# EAGLE design regulator (EAGLE 4.16)
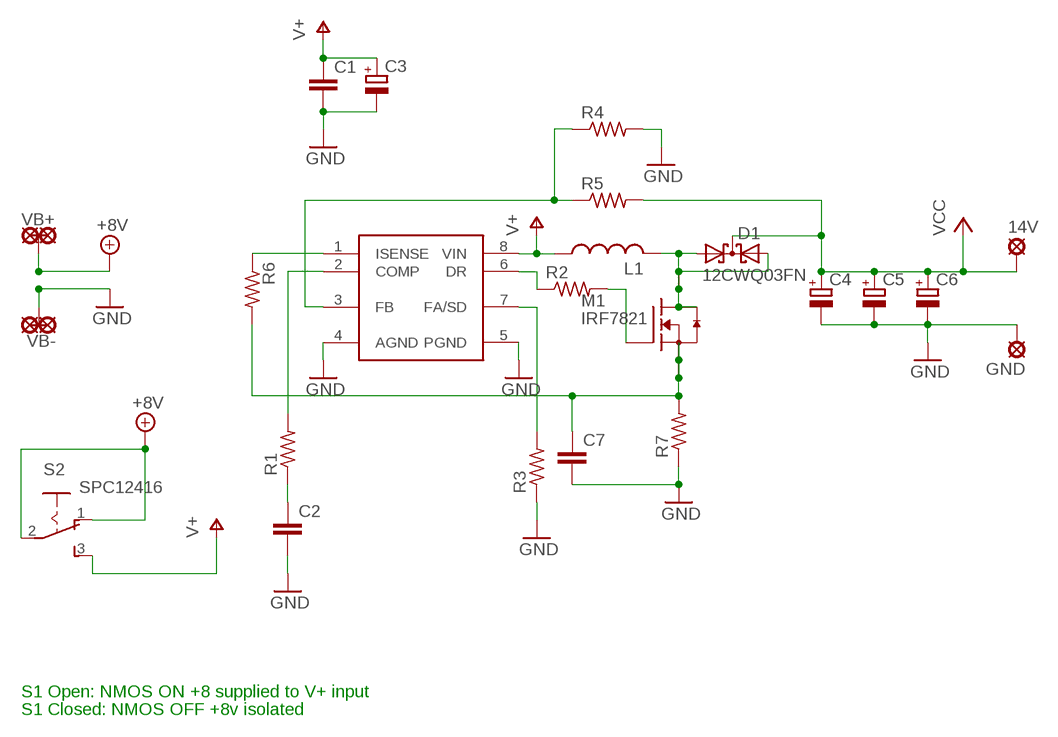
[diagram p0: schematic, sheet 1]

## Parts
14V  MCS10B20B  MCS10B0.086HOLE  [MCS10B086]
C1  C-EUC0805  [C0805]
C2  C-EUC0805  [C0805]
C3  CPOL-EUD  [PANASONIC_D]
C4  CPOL-EUG  [PANASONIC_G]
C5  CPOL-EUG  [PANASONIC_G]
C6  CPOL-EUG  [PANASONIC_G]
C7  C-EUC0805  [C0805]
D1  12CWQ03FN  [TO-252AA]
GND  MCS10B20B  MCS10B0.086HOLE  [MCS10B086]
IC1  LM3478  [MSOP08]
L1  L-US744770122  [744770122]
M1  IRF7821  [SO08]
R1  R-US_R0805  [R0805]
R2  R-US_R0805  [R0805]
R3  R-US_R0805  [R0805]
R4  R-US_R0402  [R0402]
R5  R-US_R0805  [R0805]
R6  R-US_R0402  [R0402]
R7  R-US_R1210  [R1210]
S2  SPC12416  [SPC12416]
VB+  2WAY  [2WAY]
VB-  2WAY  [2WAY]

## Nets
+8V: S2.1(O) S2.2(P) VB+.P$1 VB+.P$2
GND: C1.2 C2.2 C3.- C4.- C5.- C6.- C7.2 GND.MP IC1.4(AGND) IC1.5(PGND) R3.1 R4.2 R7.1 VB-.P$1 VB-.P$2
N$1: IC1.3(FB) R4.1 R5.1
N$3: IC1.7(FA/SD) R3.2
N$4: IC1.6(DR) R2.1
N$5: M1.4(G) R2.2
N$7: IC1.1(ISENSE) R6.1
N$8: C7.1 M1.1(S1) M1.2(S2) M1.3(S3) R6.2 R7.2
N$9: IC1.2(COMP) R1.2
N$10: C2.1 R1.1
N$11: D1.1(A1) D1.3(A2) L1.2 M1.5(D1) M1.6(D2) M1.7(D3) M1.8(D4)
V+: C1.1 C3.+ IC1.8(VIN) L1.1 S2.3(S)
VCC: 14V.MP C4.+ C5.+ C6.+ D1.2(C) R5.2

## Notes on the sheet
- S1 Open: NMOS ON +8 supplied to V+ input
- S1 Closed: NMOS OFF +8v isolated

## Library data of the parts
14V GND = solpad:MCS10B: SOLDER PAD MC S1, distributor Buerklin, 15F505
C1 C2 C7 = rcl:C-EU: CAPACITOR, European symbol
C3-C6 = rcl:CPOL-EU: POLARIZED CAPACITOR, European symbol
D1 = diode-1:12CWQ03FN
IC1 = national-semiconductor:LM3478
L1 = rcl:L-US: INDUCTOR, American symbol
M1 = ir:IRF7821
R1-R7 = rcl:R-US_: RESISTOR, American symbol
S2 = switch:SPC12416
VB+ VB- = con-bat:2WAY

## Board
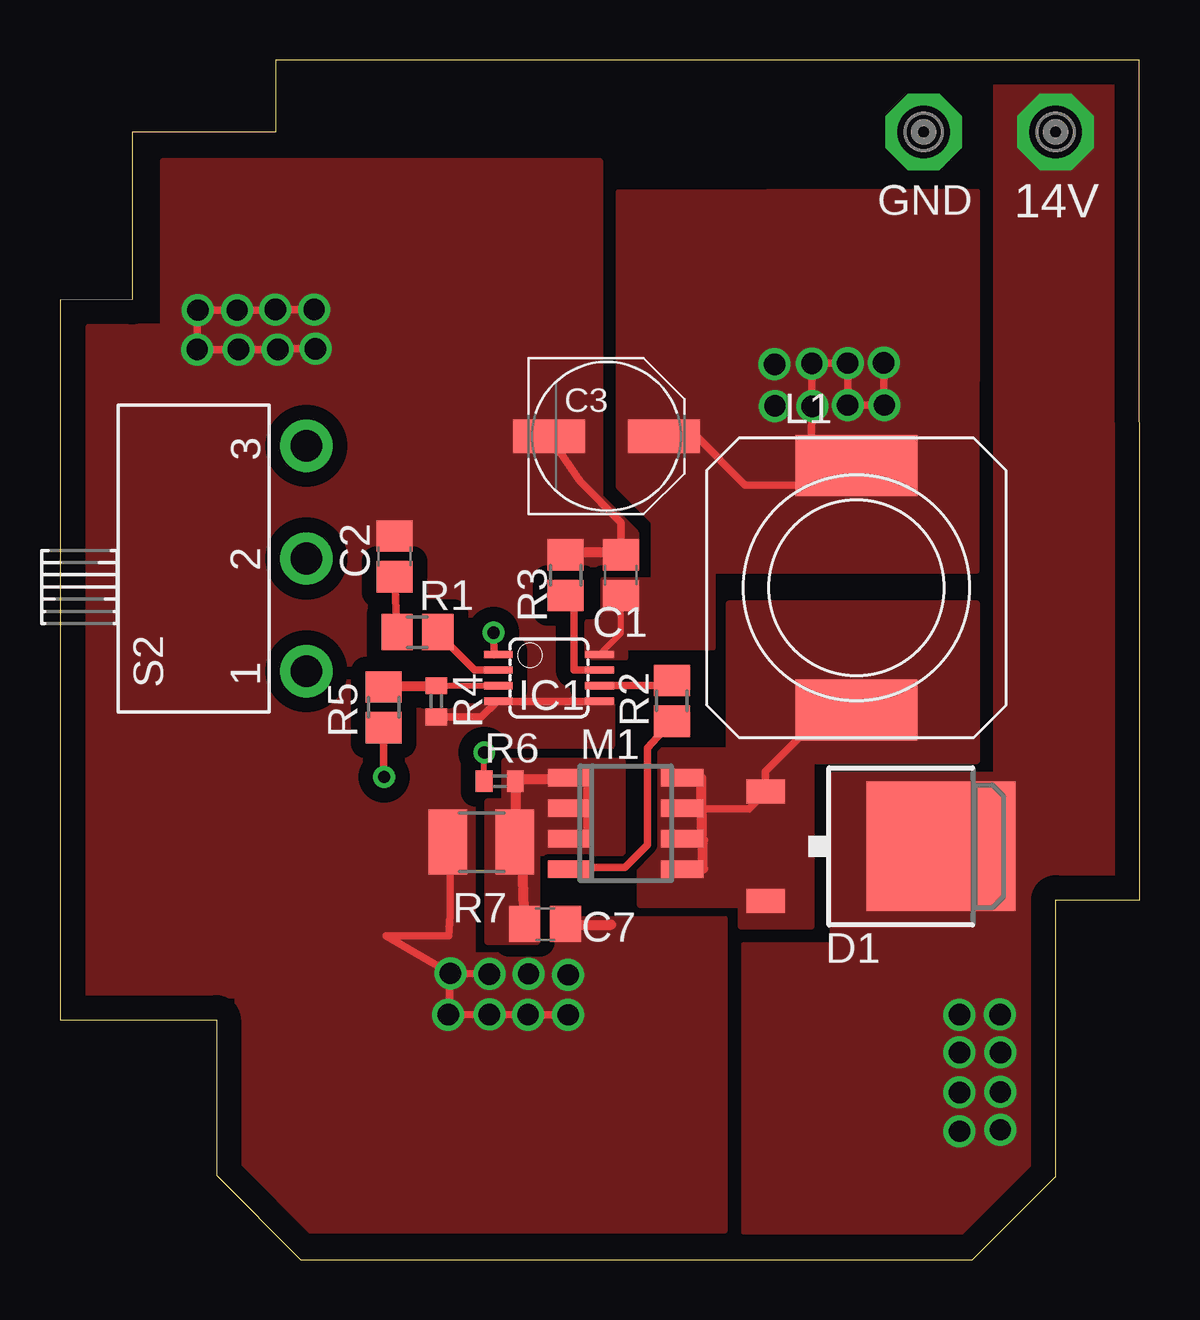
[diagram p1: board, top side]
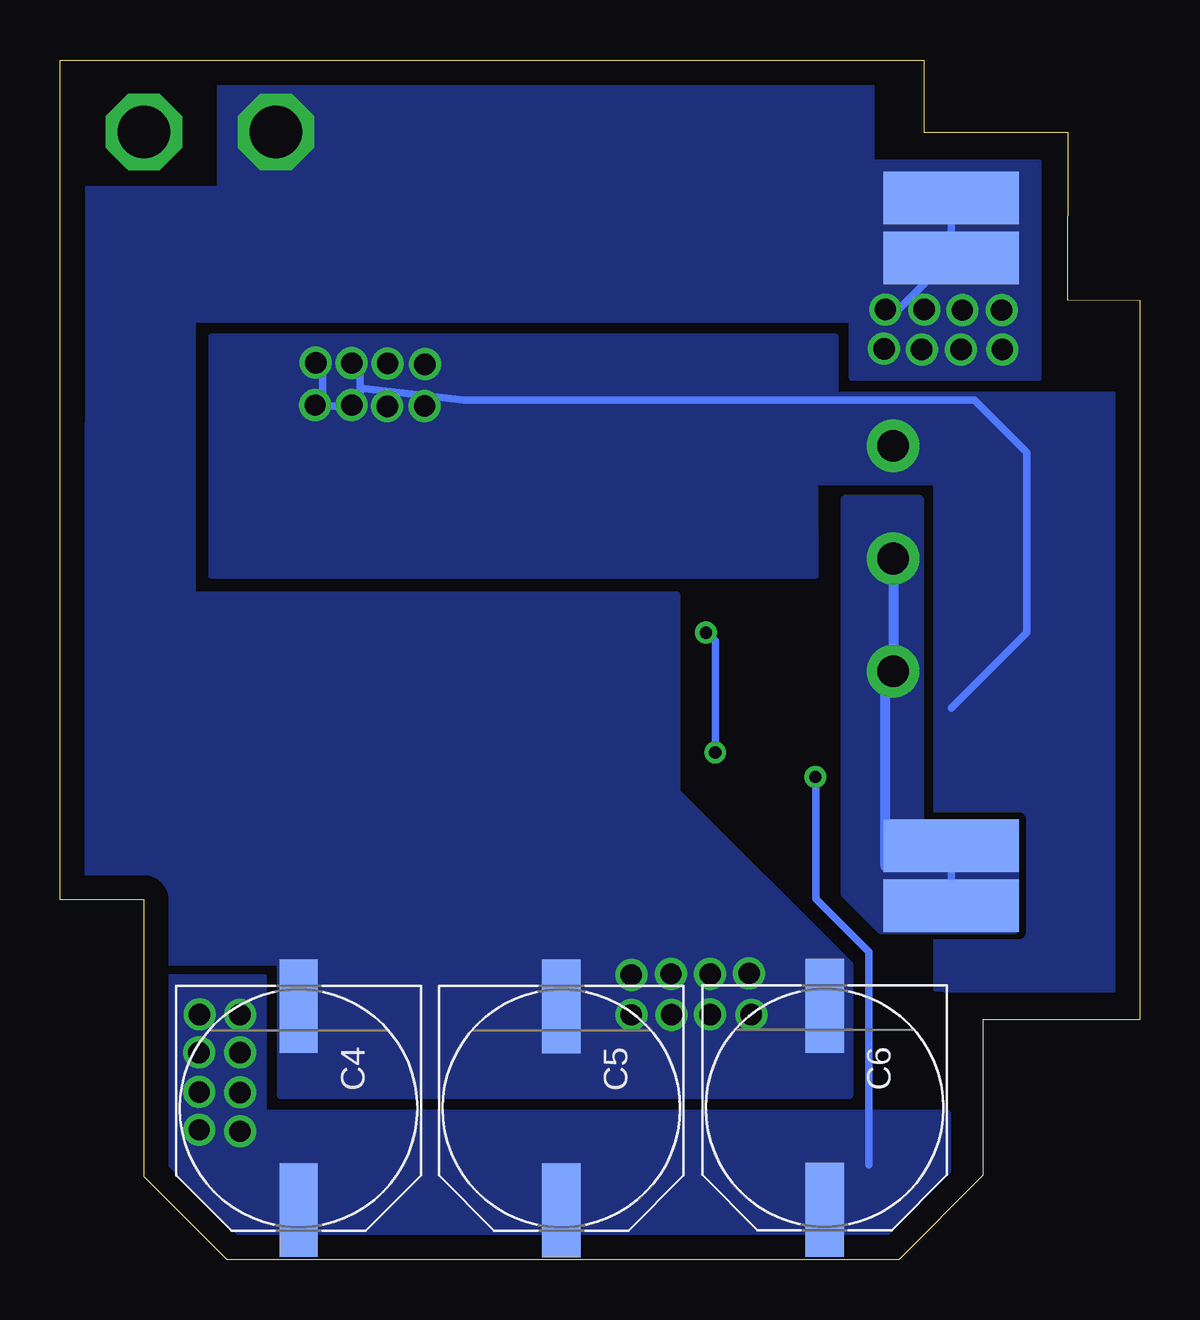
[diagram p2: board, bottom side, seen from below]

Size 45 x 50 mm. Coordinates in mm from the lower left corner, seen from the top.
Outline: 6.53,3.51 10.04,0 38.04,0 41.5,3.46 41.5,3.46 41.5,15 45,15 45,19.8 45,50 9,50 9,47 3,47 3,40 0,40 0,10 6.53,10 6.53,3.51
Copper layers (1*16): Top 0.035mm / dielectric 1.5mm / Bottom 0.035mm
Design rules "default": minimum track width 10mil, minimum drill 24mil, track to track 8mil, track to pad 8mil, pad to pad 8mil, via to via 8mil, smd to smd 8mil, copper to edge 40mil, drill to drill 8mil, minimum pad ring 10mil, minimum via ring 8mil, stop-mask expansion 4mil, vias tented up to drill 0mil, thermal gap 10mil

### Footprints (pad centres in the part's own frame; a part is rotated, then mirrored left to right if it is on the bottom)
MCS10B086 = drill 2.184 pad 3.175 octagon: MP 0,0
C0805 = smd 1.3 x 1.5: 1 -0.85,0; 2 0.85,0
PANASONIC_D = smd 3 x 1.4: + 2.4,0; - -2.4,0
PANASONIC_G = smd 3.9 x 1.6: + 4.25,0; - -4.25,0
TO-252AA = smd 1 x 1.6: 1 -2.28,-4.8; 3 2.28,-4.8 | smd 5.4 x 6.2: 2 0,2.5
MSOP08 = smd 0.3 x 1.2: 1 -0.518,-2.105; 2 0.132,-2.105; 3 0.782,-2.105; 4 1.432,-2.105; 5 1.432,2.12; 6 0.782,2.12; 7 0.132,2.12; 8 -0.518,2.12
744770122 = smd 5.08 x 2.54: 1 0,5.085; 2 0,-5.085
SO08 = smd 0.72 x 1.78: 1 -1.905,-2.35; 2 -0.635,-2.35; 3 0.635,-2.35; 4 1.905,-2.35; 5 1.905,2.35; 6 0.635,2.35; 7 -0.635,2.35; 8 -1.905,2.35
R0805 = smd 1.3 x 1.5: 1 -0.85,0; 2 0.85,0
R0402 = smd 0.7 x 0.9: 1 -0.65,0; 2 0.65,0
R1210 = smd 1.6 x 2.7: 1 -1.4,0; 2 1.4,0
SPC12416 = drill 1.321 pad 2.184 round: 1 -4.7,0; 2 0,0; 3 4.7,0
2WAY = smd 2.2 x 5.65: P$1 1.25,0.35; P$2 -1.25,0.35

### Placement (x,y rotation side)
14V  41.5,47 0 top
C1  23.38,28.52 90 top
C2  13.95,29.3 90 top
C3  22.78,34.31 0 top
C4  35.05,6.31 270 bottom
C5  24.1,6.3 270 bottom
C6  13.13,6.33 270 bottom
C7  20.22,13.98 0 top
D1  34.21,17.22 270 top
GND  36,47 0 top
IC1  20.38,24.7 270 top
L1  33.2,28 0 top
M1  23.58,18.18 270 top
R1  14.9,26.15 0 top
R2  25.5,23.29 270 top
R3  21.07,28.52 270 top
R4  15.69,23.27 270 top
R5  13.49,23.02 270 top
R6  18.33,19.94 0 top
R7  17.56,17.4 0 top
S2  10.27,29.22 90 top
VB+  7.5,16 90 bottom
VB-  7.5,43 90 bottom

### Tracks (layer width: path | path; a pad name or v marks a point on that pad's centre or on a via)
+8V
  Bottom 0.305: 7.84,14.75 7.73,14.64 | VB+.P$2 7.84,14.75 | VB+.P$1 7.85,16.38 7.85,14.76 7.84,14.75
  Bottom 0.406: 10.24,24.52 10.24,24.38 | 10.24,24.52 S2.1 10.59,24.52 10.59,16.43 | S2.2 10.24,29.22 10.24,24.52 | 10.59,16.43 10.59,16.38 | 10.59,16.43 10.54,16.43 10.54,16.38 7.85,16.38
  pour Bottom (no thermals): 5.23,18.16 5.23,13.77 10.77,13.77 12.24,15.24 12.24,31.67 9.19,31.67 9.19,18.16 5.21,18.16
GND  (via drill 0.89)
  Top 0.203: 18.21,23.27 IC1.4
  Top 0.305: R4.2 17.56,22.62 18.21,23.27 | C1.2 23.38,29.4 23.39,29.39 23.39,30.73 21.68,32.44 C3.- 21.68,34.34 21.63,34.4 | IC1.4 18.23,23.27 | 18.23,23.27 IC1.5 | 18.23,23.27 | R7.1 16.2,17.4 16.27,17.47 16.27,14.32 16.2,13.5 13.6,13.5 v16.28,11.92 | v10.65,37.96 9.11,37.96 v9.08,37.93 v7.44,37.93 v5.72,37.93 5.72,39.55 v5.75,39.58 v7.39,39.58 8.95,39.58 v8.98,39.6 v10.6,39.6 | v16.28,11.92 v17.9,11.9 | v16.28,11.92 v16.2,10.2 v16.19,10.2 v17.9,10.21 v19.5,10.2 | v19.5,10.2 v19.51,10.2 | v19.5,10.2 v21.18,10.2 | 21.07,29.47 | R3.1 21.07,29.47 | 21.07,29.47 21.04,29.51
  Top 0.406: C7.2 21.17,13.91 21.19,13.89 21.25,13.95 22.98,13.95 | R3.1 arc90 21.1,29.5 23.35,29.5 arc-90 C1.2
  Bottom 0.305: v10.6,39.6 10.06,39.6 7.85,41.81 | VB-.P$2 VB-.P$1
  Bottom 0.406: C6.- 13.13,10.62 13.16,10.65 13.27,10.55
  other vias: 19.53,11.91 21.18,11.86
  pour Bottom (isolate 0.254, no thermals): 4.21,45.76 4.21,36.73 11.98,36.73 11.98,45.74
  pour Bottom (isolate 0.254, no thermals): 35.8,6.85 12.1,6.85 12.1,12.3 19.3,19.5 19.3,27.7 39.5,27.7 39.5,39.2 11.2,39.2 11.2,49 38.3,49 38.3,44.6 44,44.6 44,15.8 40.7,15.8 40.7,12.4 35.8,12.4
  pour Top (isolate 0.61, no thermals): 22.5,45.8 22.5,31.8 24,30.3 24,28.9 19.9,28.9 19.9,26.4 20.9,26.4 20.9,24.1 21.5,23.5 23,23.5 23,21.4 17.2,21.4 17.2,12.7 20.6,12.7 20.6,14.2 27.7,14.2 27.7,1.2 27.05,1.2 10.37,1.2 7.4,4.2 7.4,11 1.2,11 1.2,38.9 4.3,38.9 4.3,45.8
N$1
  Top 0.203: R4.1 | IC1.3
  Top 0.254: R4.1 IC1.3
  Top 0.406: R4.1 15.67,23.9 13.56,23.9 R5.1
N$3
  Top 0.203: 21.09,27.59 21.08,27.57
  Top 0.305: 21.9,24.57 IC1.7 21.43,24.57 21.43,27.25 21.09,27.59 | 21.08,27.57 R3.2
N$4
  Top 0.203: IC1.6 | 25.19,23.92 R2.1
  Top 0.305: IC1.6 25.19,23.92
N$5
  Top 0.203: 22.08,16.33 22.08,16.34
  Top 0.305: R2.2 24.48,21.32 24.48,17.28 23.55,16.34 22.08,16.34 | M1.4 22.08,16.33
N$7  (via drill 0.51)
  Top 0.203: R6.1
  Top 0.254: v18.07,26.13 18.07,26.11 | R6.1 v17.69,21.14
  Top 0.305: 18.07,26.11 18.1,25.2 18.1,25.22 IC1.1
  Bottom 0.254: 18.03,26.13 v18.07,26.13
  Bottom 0.305: v17.69,21.14 17.69,25.79 18.03,26.13
N$8
  Top 0.406: 22,17.52 22,17.5 | 22,17.52 M1.3 | 22,17.52 22,18.79 M1.2 22.03,18.81 22.02,18.81 22.02,20.07 M1.1 21.98,20.03 21.98,20.02 19.06,20.02 R6.2 19.02,19.91 19.02,17.45 R7.2 18.96,17.37 19.27,17.06 C7.1
  pour Top (isolate 0.254, no thermals): 19.84,13.25 17.84,13.25 17.84,19.07 18.54,19.07 18.54,20.76 23.43,20.76 23.43,16.98 19.86,16.98 19.86,13.26
N$9
  Top 0.203: 15.85,26.14 R1.2
  Top 0.305: IC1.2 17.28,24.57 16.16,25.69 16.16,25.82 15.85,26.14
N$10
  Top 0.203: C2.1
  Top 0.305: R1.1 C2.1
N$11
  Top 0.305: 26.76,18.79 28.73,18.79 29.34,19.41 29.34,19.4 D1.1 29.41,20.33 32.22,23.14 L1.2
  Top 0.406: 26.74,18.81 | 26.74,18.81 M1.7 26.76,18.79 26.76,17.52 | M1.8 26.74,20.08 26.74,18.81 | 26.76,17.52 26.76,17.46 | 26.76,17.52 M1.6 26.81,17.47 26.81,16.3 26.76,16.3 M1.5
  pour Top (isolate 0.254, no thermals): 24.2,14.8 28.4,14.8 28.4,13.9 31.3,13.9 31.3,20.8 38.2,20.8 38.2,27.33 27.9,27.33 27.9,21.2 24.2,21.2
V+  (via drill 0.89)
  Top 0.203: 23.38,27.58 23.38,27.57 C1.1
  Top 0.254: IC1.8 23.38,26.11 23.38,27.57
  Top 0.305: L1.1 32.16,32.2 32.06,32.29 31.32,32.29 | C3.+ 26.52,34.31 26.52,34.32 28.55,32.29 31.32,32.29 | 31.32,32.29 v31.34,37.35 31.36,37.36 v32.84,37.36 v32.84,35.61 v34.37,35.61 34.34,35.64 v34.34,37.38
  Bottom 0.305: 7.85,22.98 4.7,26.14 4.7,33.64 6.88,35.82 28.16,35.82 32.48,36.33 | 32.47,37.3 32.48,37.32 32.48,36.33 | 32.48,36.33 32.48,35.6 32.5,35.58 34.04,35.58 34.06,35.57 34.06,37.33 34.04,37.35 | 32.48,36.33 32.49,36.33
  other vias: 29.78,37.32 29.8,35.58 31.36,35.57
  pour Bottom (isolate 0.305, no thermals): 8.16,11.27 1.01,11.27 1.01,36.03 12.66,36.03 12.66,38.46 38.7,38.46 38.7,28.52 13.48,28.52 13.5,32.4 8.53,32.4 8.5,32.4 8.5,11.3 8.1,11.3
  pour Top (isolate 0.254, no thermals): 38.23,44.52 38.2,28.7 27.2,28.7 27.2,25.5 26.59,25.51 23.56,25.51 23.56,25.09 22.21,25.09 21.99,25.32 21.99,26.57 22.65,26.57 22.65,28.33 24.76,28.33 24.76,30.74 23.3,32.2 23.3,44.5 35.62,44.52
VCC  (via drill 0.51, 0.89)
  Top 0.203: v13.51,20.11 13.49,20.2
  Top 0.305: 13.49,20.2 R5.2
  Top 0.406: D1.2 36.71,18.95
  Bottom 0.203: C5.+ 24.1,2
  Bottom 0.254: 24.1,2 24.11,2 | C6.+ 13.13,2 | 13.16,2.08 13.23,2 | v13.51,20.11 v13.5,20.1 13.49,20.06
  Bottom 0.305: 13.49,20.06 13.48,15.03 11.27,12.82 11.27,3.96
  other vias: 37.49,6.96 39.2,6.99 39.21,8.63 37.5,10.21 37.5,8.63 39.18,10.21 37.49,5.35 39.2,5.41
  pour Bottom (isolate 0.254, no thermals): 8.33,6.11 36.48,6.11 36.48,11.77 40.98,11.77 40.98,3.56 37.94,0.52 10.45,0.52 7.97,3 7.97,6.1 8.3,6.1
  pour Top (isolate 0.254, no thermals): 37.84,1.17 40.87,4.17 40.8,15.7 44.3,15.7 44.4,49.5 39,49.5 39,20.2 32.2,20.2 32.21,13.11 30.9,13.1 28.5,13.1 28.51,9.72 28.51,1.17 36.42,1.17

### Text on the board
Top: Top Copper Layer